# EAGLE design usbC_adapter (EAGLE 7.7.0)
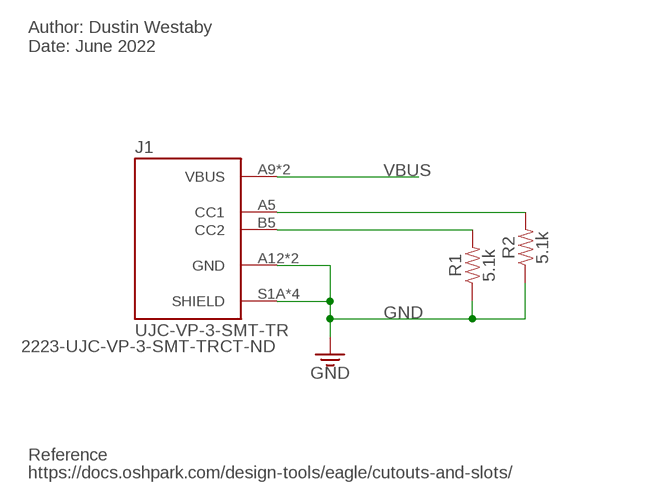
[diagram p0: schematic, sheet 1]

## Parts
J1  UJC-VP-3-SMT-TR  [CUI_UJC-VP-3-SMT-TR]
R1  5.1k  5.1KOHM-0402T-1/16W-1%  [0402-TIGHT]
R2  5.1k  5.1KOHM-0402T-1/16W-1%  [0402-TIGHT]

## Nets
GND: J1.A12(GND) J1.B12(GND) J1.S1A(SHIELD) J1.S1B(SHIELD) J1.S2A(SHIELD) J1.S2B(SHIELD) R1.1 R2.1
N$1: J1.B5(CC2) R1.2
N$2: J1.A5(CC1) R2.2
VBUS: J1.A9(VBUS) J1.B9(VBUS)

## Notes on the sheet
- Author: Dustin Westaby
  Date: June 2022
- 2223-UJC-VP-3-SMT-TRCT-ND
- Reference
- https://docs.oshpark.com/design-tools/eagle/cutouts-and-slots/

## Library data of the parts
J1 = UJC-VP-3-SMT-TR:UJC-VP-3-SMT-TR: USB Receptacle; MANUFACTURER: CUI Devices; MAXIMUM_PACKAGE_HEIGHT: 6.5mm; PARTREV: 1.0; STANDARD: Manufacturer Recommendations
R1 R2 = SparkFun-Resistors:5.1KOHM; PROD_ID: RES-14340

## Board
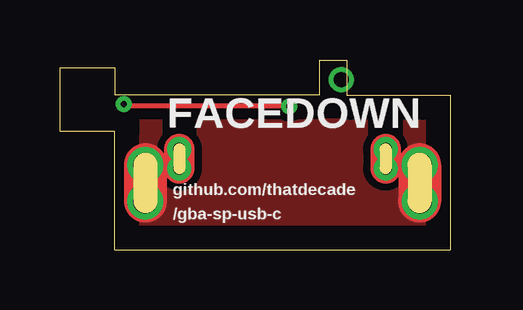
[diagram p1: board, top side]
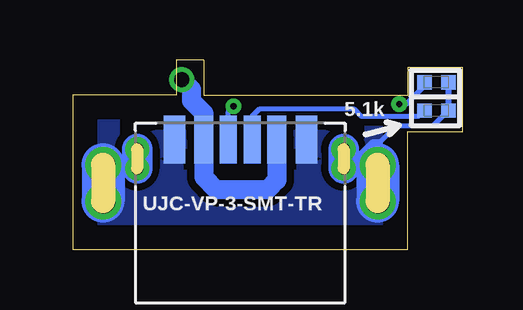
[diagram p2: board, bottom side, seen from below]

Size 16.26 x 7.94 mm. Coordinates in mm from the lower left corner, seen from the top.
Outline: 10.79,7.94 11.94,7.94 11.94,6.48 16.26,6.48 16.26,0 2.29,0 2.29,4.95 0,4.95 0,7.62 2.29,7.62 2.29,6.48 10.79,6.48 10.79,7.94
Copper layers (1*16): Top 0.035mm / dielectric 1.5mm / Bottom 0.035mm
Design rules "default *": minimum track width 10mil, minimum drill 24mil, track to track 8mil, track to pad 8mil, pad to pad 8mil, via to via 8mil, smd to smd 8mil, copper to edge 40mil, drill to drill 8mil, minimum pad ring 10mil, minimum via ring 8mil, stop-mask expansion 4mil, vias tented up to drill 15mil, thermal gap 10mil
Milling: 2 lines

### Footprints (pad centres in the part's own frame; a part is rotated, then mirrored left to right if it is on the bottom)
CUI_UJC-VP-3-SMT-TR = smd 0.7 x 2: A5 0.5,0.8; B5 -0.5,0.8 | smd 0.8 x 2: A9 -1.52,0.8; B9 1.52,0.8 | smd 0.9 x 2: A12 -2.75,0.8; B12 2.75,0.8 | drill 0.5: S1A -4.3,0.4; S1B -4.3,-0.4; S2A 4.3,0.4; S2B 4.3,-0.4
0402-TIGHT = smd 0.6 x 0.6: 1 -0.5,0; 2 0.5,0

### Placement (x,y rotation side)
J1  9.27,3.81 0 bottom
R1  1.11,7 180 bottom
R2  1.11,5.82 180 bottom

### Tracks (layer width: path | path; a pad name or v marks a point on that pad's centre or on a via)
GND  (via drill 1)
  Top 1.8: v14.99,3.56 v14.99,2.03 | v3.56,3.56 v3.56,2.03
  Bottom 0.203: 3.46,4.5 2.76,5.2 1.23,5.2 R2.1
  Bottom 0.254: 4.81,4 4.26,4 3.76,4.5 3.46,4.5 | R1.1 R2.1
  Bottom 1.8: v14.99,3.56 v14.99,2.03 | v3.56,3.56 v3.56,2.03
  pour Bottom (isolate 0.305): 16.26,7.62 16.26,0 -0.25,0 -0.25,7.62
  pour Top (isolate 0.305): 17.53,7.62 17.53,0 -0.25,0 -0.25,7.62
N$1  (via drill 0.25)
  Top 0.203: v9.56,6 2.76,6
  Top 0.254: 2.76,6 v2.66,6.1
  Bottom 0.203: J1.B5 9.77,5.79 v9.56,6 | v2.66,6.1 2.36,6.1 1.61,6.85
  Bottom 0.254: 1.61,6.85 R1.2
N$2
  Bottom 0.203: 8.77,5.58 8.46,5.9 4.56,5.9 4.26,5.6 1.83,5.6 R2.2
  Bottom 0.254: J1.A5 8.77,5.58
VBUS  (via drill 0.64)
  Bottom 0.8: J1.B9 7.75,2.92 8.13,2.54 10.29,2.54 10.79,3.04 J1.A9 10.79,5.71 11.3,6.22 11.3,6.7 v11.71,7.11

### Text on the board
tPlace: FACEDOWN | github.com/thatdecade | /gba-sp-usb-c
bPlace: 5.1k | UJC-VP-3-SMT-TR